# Altium schematic sheet LDO_5V.SchDoc
size A
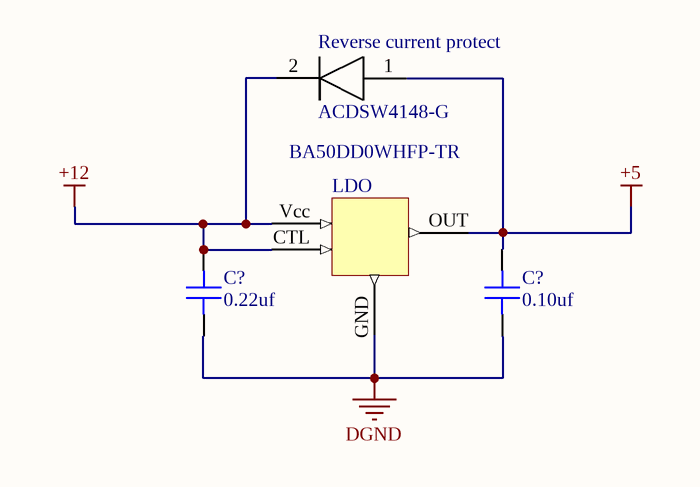
[diagram p0: LDO_5V.SchDoc]

## Parts
(Parts that share a designator on the sheet are numbered #1, #2 ... from top to bottom, then left to right.)
C?#1  value 0.22uf  [CAP 0805/2012]  (hidden comment: Capacitor MLCC 0.22uf 50V CAP 0805/2012)
C?#2  value 0.10uf  [CAP 0805/2012]  (hidden comment: Capacitor MLCC 0.10uf 50V CAP 0805/2012)
LDO  BA50DD0WHFP-TR  [HRP5]
Reverse_current_protect  ACDSW4148-G  [DIODE SOD-123]

## Nets
+5: C?#2.2 LDO.OUT Reverse_current_protect.1
+12: C?#1.2 LDO.CTL LDO.Vcc Reverse_current_protect.2
DGND: C?#1.1 C?#2.1 LDO.GND

## Library data of the parts
C?#1 = 1065: Manufacturer_id: 1; idCapacitor: 1065; Name: Cap_0.22uf_50V_CAP 0805/2012; Dielectric: Ceramic; Created_By: Nick Mah; Drawer_id: 1; Voltage_Rating: 50V; Package: CAP 0805/2012; Created_Date: 10/20/2018
C?#2 = 1063: Manufacturer_id: 1; idCapacitor: 1063; Name: Cap_0.10uf_50V_CAP 0805/2012; Dielectric: Ceramic; Created_By: Nick Mah; Drawer_id: 1; Voltage_Rating: 50V; Package: CAP 0805/2012; Created_Date: 10/20/2018
LDO = 6: Manufacturer_id: 1; idPMIC_Lin: 6; Name: BA50DD0WHFP-TR Linear Voltage Regulator 5; Value: 5V; Vin(Min): 3V; Vin(Max): 33V; Current_Rating: 2A; Dropout_Voltage: 0.7V; Drawer_id: 1; Vout(Max): 5V; Link: https://www.mouser.com/ProductDetail/ROHM-Semiconductor/BA50DD0WHFP-TR?qs=4kLU8WoGk0sFpKnESpdNFg%3D%3D
Reverse_current_protect = 9: Manufacturer_id: 1; idDiode: 9; Drawer_id: 1; Name: ACDSW4148-G Swtiching Diode; ComponentLink1URL: https://www.mouser.com/ProductDetail/Comchip-Technology/ACDSW4148-G?qs=vdiGlTBG6Jtfiahn88v1XQ%3D%3D